# Vivado block design design_1, xczu28dr-ffvg1517-2-e, Vivado 2019.1
# (continued, part 2 of 3)
current_bd_instance /SPB_blocks

create_bd_cell -type hier PD_FLAG_block
create_bd_cell -type hier stream_0
create_bd_cell -type hier stream_1
create_bd_cell -type hier stream_2
create_bd_cell -type hier stream_3
create_bd_cell -type hier soft_reset
create_bd_cell -type ip -vlnv xilinx.com:ip:ila:6.2 ila_0
set_property -dict [list \
  CONFIG.C_ENABLE_ILA_AXI_MON false \
  CONFIG.C_MONITOR_TYPE Native \
  CONFIG.C_NUM_OF_PROBES 6 \
  CONFIG.C_TRIGIN_EN false \
] [get_bd_cells ila_0]

# ---- hierarchy /SPB_blocks/PD_FLAG_block ----
current_bd_instance /SPB_blocks/PD_FLAG_block
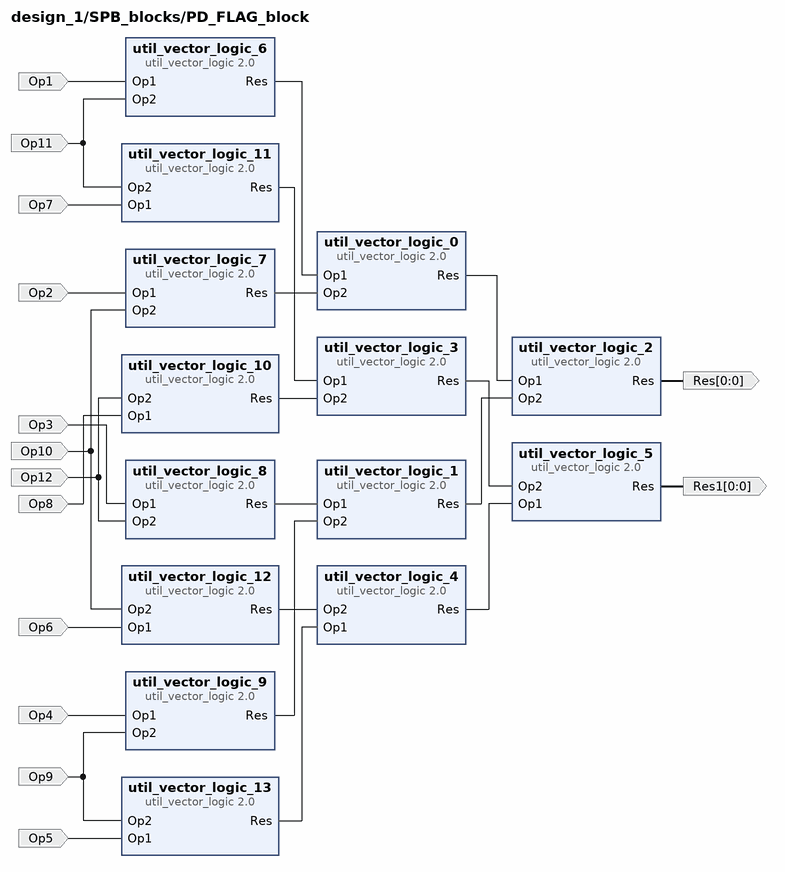
[diagram p20: block diagram inside /SPB_blocks/PD_FLAG_block]
create_bd_pin -dir I Op2
create_bd_pin -dir I Op3
create_bd_pin -dir I Op4
create_bd_pin -dir O -from 0 -to 0 Res
create_bd_pin -dir I Op5
create_bd_pin -dir O -from 0 -to 0 Res1
create_bd_pin -dir I Op6
create_bd_pin -dir I Op7
create_bd_pin -dir I Op8
create_bd_pin -dir I Op1
create_bd_pin -dir I Op9
create_bd_pin -dir I Op10
create_bd_pin -dir I Op11
create_bd_pin -dir I Op12

create_bd_cell -type ip -vlnv xilinx.com:ip:util_vector_logic:2.0 util_vector_logic_0
set_property -dict {CONFIG.C_OPERATION or CONFIG.C_SIZE 1} [get_bd_cells util_vector_logic_0]
create_bd_cell -type ip -vlnv xilinx.com:ip:util_vector_logic:2.0 util_vector_logic_1
set_property -dict {CONFIG.C_OPERATION or CONFIG.C_SIZE 1} [get_bd_cells util_vector_logic_1]
create_bd_cell -type ip -vlnv xilinx.com:ip:util_vector_logic:2.0 util_vector_logic_2
set_property -dict {CONFIG.C_OPERATION or CONFIG.C_SIZE 1} [get_bd_cells util_vector_logic_2]
create_bd_cell -type ip -vlnv xilinx.com:ip:util_vector_logic:2.0 util_vector_logic_3
set_property -dict {CONFIG.C_OPERATION or CONFIG.C_SIZE 1} [get_bd_cells util_vector_logic_3]
create_bd_cell -type ip -vlnv xilinx.com:ip:util_vector_logic:2.0 util_vector_logic_4
set_property -dict {CONFIG.C_OPERATION or CONFIG.C_SIZE 1} [get_bd_cells util_vector_logic_4]
create_bd_cell -type ip -vlnv xilinx.com:ip:util_vector_logic:2.0 util_vector_logic_5
set_property -dict {CONFIG.C_OPERATION or CONFIG.C_SIZE 1} [get_bd_cells util_vector_logic_5]
create_bd_cell -type ip -vlnv xilinx.com:ip:util_vector_logic:2.0 util_vector_logic_6
set_property -dict {CONFIG.C_OPERATION and CONFIG.C_SIZE 1} [get_bd_cells util_vector_logic_6]
create_bd_cell -type ip -vlnv xilinx.com:ip:util_vector_logic:2.0 util_vector_logic_7
set_property -dict {CONFIG.C_OPERATION and CONFIG.C_SIZE 1} [get_bd_cells util_vector_logic_7]
create_bd_cell -type ip -vlnv xilinx.com:ip:util_vector_logic:2.0 util_vector_logic_8
set_property -dict {CONFIG.C_OPERATION and CONFIG.C_SIZE 1} [get_bd_cells util_vector_logic_8]
create_bd_cell -type ip -vlnv xilinx.com:ip:util_vector_logic:2.0 util_vector_logic_9
set_property -dict {CONFIG.C_OPERATION and CONFIG.C_SIZE 1} [get_bd_cells util_vector_logic_9]
create_bd_cell -type ip -vlnv xilinx.com:ip:util_vector_logic:2.0 util_vector_logic_10
set_property -dict {CONFIG.C_OPERATION and CONFIG.C_SIZE 1} [get_bd_cells util_vector_logic_10]
create_bd_cell -type ip -vlnv xilinx.com:ip:util_vector_logic:2.0 util_vector_logic_11
set_property -dict {CONFIG.C_OPERATION and CONFIG.C_SIZE 1} [get_bd_cells util_vector_logic_11]
create_bd_cell -type ip -vlnv xilinx.com:ip:util_vector_logic:2.0 util_vector_logic_12
set_property -dict {CONFIG.C_OPERATION and CONFIG.C_SIZE 1} [get_bd_cells util_vector_logic_12]
create_bd_cell -type ip -vlnv xilinx.com:ip:util_vector_logic:2.0 util_vector_logic_13
set_property -dict {CONFIG.C_OPERATION and CONFIG.C_SIZE 1} [get_bd_cells util_vector_logic_13]

# ---- hierarchy /SPB_blocks/stream_0 ----
current_bd_instance /SPB_blocks/stream_0
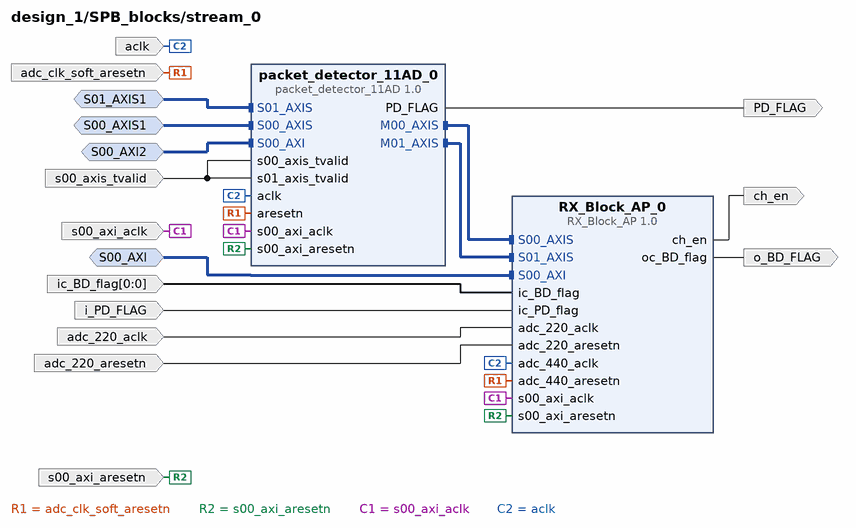
[diagram p21: block diagram inside /SPB_blocks/stream_0]
create_bd_intf_pin -mode Slave -vlnv xilinx.com:interface:axis_rtl:1.0 S01_AXIS1
create_bd_intf_pin -mode Slave -vlnv xilinx.com:interface:aximm_rtl:1.0 S00_AXI2
create_bd_intf_pin -mode Slave -vlnv xilinx.com:interface:axis_rtl:1.0 S00_AXIS1
create_bd_intf_pin -mode Slave -vlnv xilinx.com:interface:aximm_rtl:1.0 S00_AXI
create_bd_pin -dir I -type rst adc_clk_soft_aresetn
create_bd_pin -dir I -type rst s00_axi_aresetn
create_bd_pin -dir I -type clk s00_axi_aclk
create_bd_pin -dir I -type clk aclk
create_bd_pin -dir O PD_FLAG
create_bd_pin -dir I i_PD_FLAG
create_bd_pin -dir O o_BD_FLAG
create_bd_pin -dir I -from 0 -to 0 ic_BD_flag
create_bd_pin -dir I -type clk adc_220_aclk
create_bd_pin -dir I -type rst adc_220_aresetn
create_bd_pin -dir O ch_en
create_bd_pin -dir I s00_axis_tvalid

create_bd_cell -type ip -vlnv user.org:user:RX_Block_AP:1.0 RX_Block_AP_0
create_bd_cell -type ip -vlnv user.org:user:packet_detector_11AD:1.0 packet_detector_11AD_0

# ---- hierarchy /SPB_blocks/stream_1 ----
current_bd_instance /SPB_blocks/stream_1
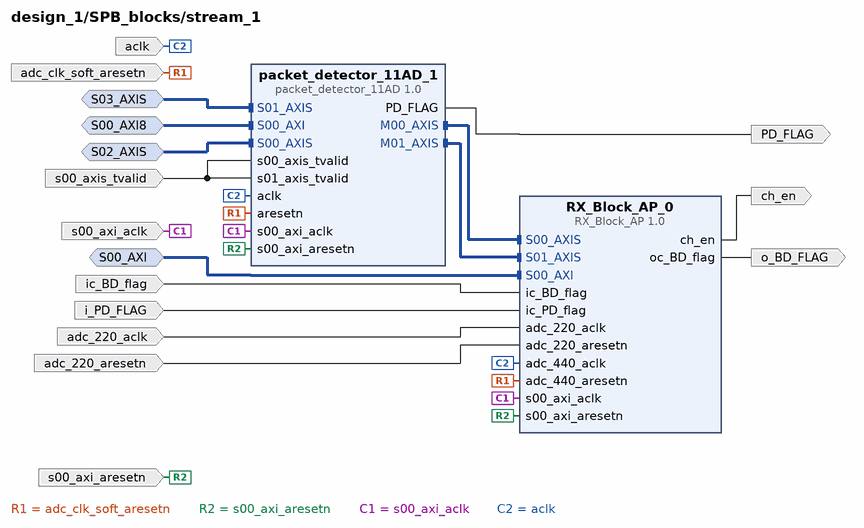
[diagram p22: block diagram inside /SPB_blocks/stream_1]
create_bd_intf_pin -mode Slave -vlnv xilinx.com:interface:axis_rtl:1.0 S03_AXIS
create_bd_intf_pin -mode Slave -vlnv xilinx.com:interface:aximm_rtl:1.0 S00_AXI8
create_bd_intf_pin -mode Slave -vlnv xilinx.com:interface:axis_rtl:1.0 S02_AXIS
create_bd_intf_pin -mode Slave -vlnv xilinx.com:interface:aximm_rtl:1.0 S00_AXI
create_bd_pin -dir I -type rst adc_clk_soft_aresetn
create_bd_pin -dir I -type rst s00_axi_aresetn
create_bd_pin -dir I -type clk s00_axi_aclk
create_bd_pin -dir I -type clk aclk
create_bd_pin -dir O PD_FLAG
create_bd_pin -dir I i_PD_FLAG
create_bd_pin -dir O o_BD_FLAG
create_bd_pin -dir I ic_BD_flag
create_bd_pin -dir I -type clk adc_220_aclk
create_bd_pin -dir I -type rst adc_220_aresetn
create_bd_pin -dir O ch_en
create_bd_pin -dir I s00_axis_tvalid

create_bd_cell -type ip -vlnv user.org:user:RX_Block_AP:1.0 RX_Block_AP_0
set_property -dict {CONFIG.STREAM 1} [get_bd_cells RX_Block_AP_0]
create_bd_cell -type ip -vlnv user.org:user:packet_detector_11AD:1.0 packet_detector_11AD_1

# ---- hierarchy /SPB_blocks/stream_2 ----
current_bd_instance /SPB_blocks/stream_2
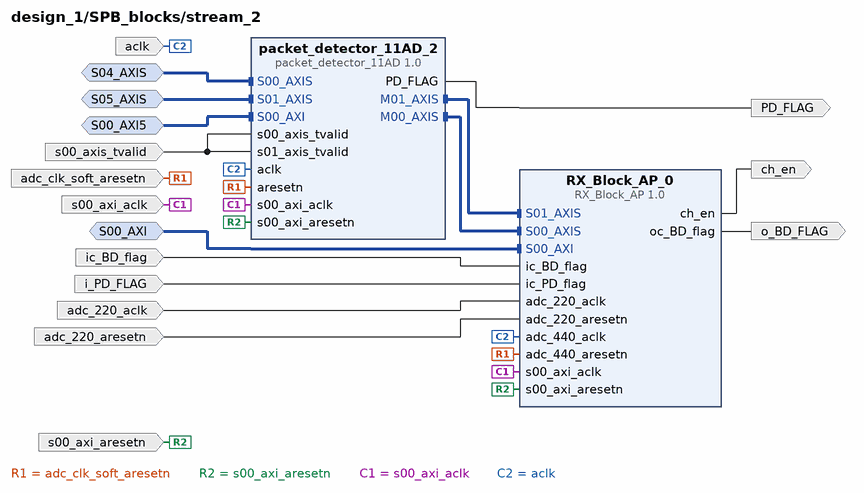
[diagram p23: block diagram inside /SPB_blocks/stream_2]
create_bd_intf_pin -mode Slave -vlnv xilinx.com:interface:aximm_rtl:1.0 S00_AXI5
create_bd_intf_pin -mode Slave -vlnv xilinx.com:interface:axis_rtl:1.0 S04_AXIS
create_bd_intf_pin -mode Slave -vlnv xilinx.com:interface:axis_rtl:1.0 S05_AXIS
create_bd_intf_pin -mode Slave -vlnv xilinx.com:interface:aximm_rtl:1.0 S00_AXI
create_bd_pin -dir I -type rst adc_clk_soft_aresetn
create_bd_pin -dir I -type rst s00_axi_aresetn
create_bd_pin -dir I -type clk s00_axi_aclk
create_bd_pin -dir I -type clk aclk
create_bd_pin -dir O PD_FLAG
create_bd_pin -dir I i_PD_FLAG
create_bd_pin -dir O o_BD_FLAG
create_bd_pin -dir I ic_BD_flag
create_bd_pin -dir I -type clk adc_220_aclk
create_bd_pin -dir I -type rst adc_220_aresetn
create_bd_pin -dir O ch_en
create_bd_pin -dir I s00_axis_tvalid

create_bd_cell -type ip -vlnv user.org:user:RX_Block_AP:1.0 RX_Block_AP_0
set_property -dict {CONFIG.STREAM 2} [get_bd_cells RX_Block_AP_0]
create_bd_cell -type ip -vlnv user.org:user:packet_detector_11AD:1.0 packet_detector_11AD_2

# ---- hierarchy /SPB_blocks/stream_3 ----
current_bd_instance /SPB_blocks/stream_3
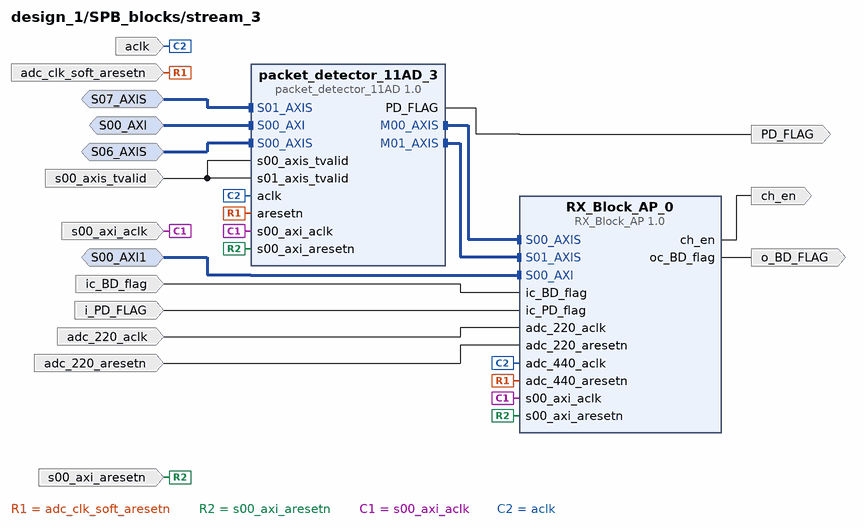
[diagram p24: block diagram inside /SPB_blocks/stream_3]
create_bd_intf_pin -mode Slave -vlnv xilinx.com:interface:aximm_rtl:1.0 S00_AXI
create_bd_intf_pin -mode Slave -vlnv xilinx.com:interface:axis_rtl:1.0 S06_AXIS
create_bd_intf_pin -mode Slave -vlnv xilinx.com:interface:axis_rtl:1.0 S07_AXIS
create_bd_intf_pin -mode Slave -vlnv xilinx.com:interface:aximm_rtl:1.0 S00_AXI1
create_bd_pin -dir I -type rst adc_clk_soft_aresetn
create_bd_pin -dir I -type rst s00_axi_aresetn
create_bd_pin -dir I -type clk s00_axi_aclk
create_bd_pin -dir I -type clk aclk
create_bd_pin -dir O PD_FLAG
create_bd_pin -dir I i_PD_FLAG
create_bd_pin -dir I ic_BD_flag
create_bd_pin -dir O o_BD_FLAG
create_bd_pin -dir I -type clk adc_220_aclk
create_bd_pin -dir I -type rst adc_220_aresetn
create_bd_pin -dir O ch_en
create_bd_pin -dir I s00_axis_tvalid

create_bd_cell -type ip -vlnv user.org:user:RX_Block_AP:1.0 RX_Block_AP_0
set_property -dict {CONFIG.STREAM 3} [get_bd_cells RX_Block_AP_0]
create_bd_cell -type ip -vlnv user.org:user:packet_detector_11AD:1.0 packet_detector_11AD_3

# ---- hierarchy /SPB_blocks/soft_reset ----
current_bd_instance /SPB_blocks/soft_reset
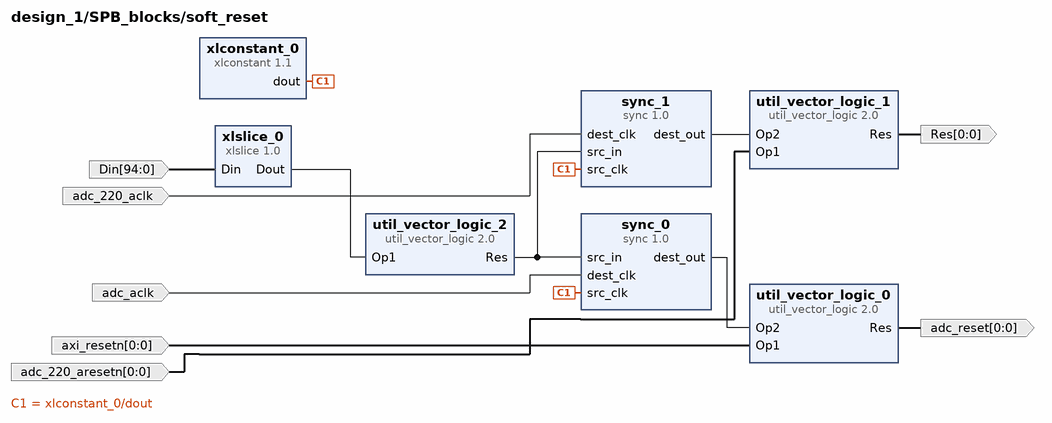
[diagram p25: block diagram inside /SPB_blocks/soft_reset]
create_bd_pin -dir I -type clk adc_aclk
create_bd_pin -dir I -from 0 -to 0 axi_resetn
create_bd_pin -dir O -from 0 -to 0 adc_reset
create_bd_pin -dir I -from 94 -to 0 Din
create_bd_pin -dir I -from 0 -to 0 adc_220_aresetn
create_bd_pin -dir O -from 0 -to 0 Res
create_bd_pin -dir I -type clk adc_220_aclk

create_bd_cell -type ip -vlnv xilinx.com:ip:xlslice:1.0 xlslice_0
set_property -dict {CONFIG.DIN_FROM 29 CONFIG.DIN_TO 29 CONFIG.DIN_WIDTH 95 CONFIG.DOUT_WIDTH 1} [get_bd_cells xlslice_0]
create_bd_cell -type ip -vlnv xilinx.com:ip:util_vector_logic:2.0 util_vector_logic_2
set_property -dict {CONFIG.C_OPERATION not CONFIG.C_SIZE 1} [get_bd_cells util_vector_logic_2]
create_bd_cell -type ip -vlnv xilinx.com:user:sync:1.0 sync_0
set_property -dict {CONFIG.SRC_INPUT_REG 0} [get_bd_cells sync_0]
create_bd_cell -type ip -vlnv xilinx.com:ip:xlconstant:1.1 xlconstant_0
set_property -dict {CONFIG.CONST_VAL 0} [get_bd_cells xlconstant_0]
create_bd_cell -type ip -vlnv xilinx.com:ip:util_vector_logic:2.0 util_vector_logic_0
set_property -dict {CONFIG.C_SIZE 1} [get_bd_cells util_vector_logic_0]
create_bd_cell -type ip -vlnv xilinx.com:ip:util_vector_logic:2.0 util_vector_logic_1
set_property -dict {CONFIG.C_SIZE 1} [get_bd_cells util_vector_logic_1]
create_bd_cell -type ip -vlnv xilinx.com:user:sync:1.0 sync_1
set_property -dict {CONFIG.SRC_INPUT_REG 0} [get_bd_cells sync_1]

# ---- connections ----

current_bd_instance /MTS_Block
connect_bd_intf_net [get_bd_intf_pins CLK_DIFF_PL_CLK] [get_bd_intf_pins util_ds_buf_0/CLK_IN_D]
connect_bd_intf_net [get_bd_intf_pins CLK_DIFF_SYSREF_CLK] [get_bd_intf_pins util_ds_buf_1/CLK_IN_D]
connect_bd_net [get_bd_pins util_ds_buf_0/IBUF_OUT] [get_bd_pins clk_wiz_0/clk_in1] [get_bd_pins sync_0/dest_clk]
connect_bd_net [get_bd_pins sync_0/dest_out] [get_bd_pins sync_1/src_in] [get_bd_pins sync_2/src_in]
connect_bd_net [get_bd_pins sync_1/dest_out] [get_bd_pins user_sysref_dac]
connect_bd_net [get_bd_pins xlconstant_0/dout] [get_bd_pins sync_0/src_clk] [get_bd_pins sync_1/src_clk] [get_bd_pins sync_2/src_clk]
connect_bd_net [get_bd_pins util_ds_buf_1/IBUF_OUT] [get_bd_pins sync_0/src_in]
connect_bd_net [get_bd_pins sync_2/dest_out] [get_bd_pins user_sysref_adc]
connect_bd_net [get_bd_pins clk_wiz_0/clk_out3] [get_bd_pins adc45_clk] [get_bd_pins sync_2/dest_clk]
connect_bd_net [get_bd_pins clk_wiz_0/clk_out1] [get_bd_pins dac45_clk] [get_bd_pins sync_1/dest_clk]
connect_bd_net [get_bd_pins clk_wiz_0/clk_out2] [get_bd_pins dac_clk]
connect_bd_net [get_bd_pins clk_wiz_0/clk_out4] [get_bd_pins adc_clk]

current_bd_instance /reset_block
connect_bd_net -net zynq_ultra_ps_e_0_pl_clk0 [get_bd_pins slowest_sync_clk] [get_bd_pins rst_ps8_0_96M/slowest_sync_clk]
connect_bd_net -net zynq_ultra_ps_e_0_pl_resetn0 [get_bd_pins ext_reset_in] \
  [get_bd_pins rst_ps8_0_96M1/ext_reset_in] [get_bd_pins rst_ps8_0_96M/ext_reset_in] \
  [get_bd_pins rst_ps8_0_96M2/ext_reset_in]
connect_bd_net [get_bd_pins rst_ps8_0_96M/peripheral_aresetn] [get_bd_pins peripheral_aresetn]
connect_bd_net -net MTS_Block_dac_clk [get_bd_pins slowest_sync_clk1] [get_bd_pins rst_ps8_0_96M1/slowest_sync_clk]
connect_bd_net [get_bd_pins rst_ps8_0_96M1/peripheral_aresetn] [get_bd_pins peripheral_aresetn1]
connect_bd_net [get_bd_pins rst_ddr4_0_333M/peripheral_aresetn] [get_bd_pins peripheral_aresetn2]
connect_bd_net -net slowest_sync_clk2_1 [get_bd_pins slowest_sync_clk2] [get_bd_pins rst_ddr4_0_333M/slowest_sync_clk]
connect_bd_net -net ext_reset_in1_1 [get_bd_pins ext_reset_in1] [get_bd_pins rst_ddr4_0_333M/ext_reset_in]
connect_bd_net [get_bd_pins rst_ps8_0_96M2/peripheral_aresetn] [get_bd_pins peripheral_aresetn3]
connect_bd_net -net slowest_sync_clk3_1 [get_bd_pins slowest_sync_clk3] [get_bd_pins rst_ps8_0_96M2/slowest_sync_clk]

current_bd_instance /dac_dma_block
connect_bd_intf_net [get_bd_intf_pins M_AXI_MM2S] [get_bd_intf_pins axi_register_slice_0/M_AXI]
connect_bd_intf_net [get_bd_intf_pins axi_register_slice_0/S_AXI] [get_bd_intf_pins axi_dma_0/M_AXI_MM2S]
connect_bd_intf_net [get_bd_intf_pins S_AXI_LITE] [get_bd_intf_pins axi_dma_0/S_AXI_LITE]
connect_bd_intf_net [get_bd_intf_pins M03_AXIS] [get_bd_intf_pins axis_broadcaster_0/M03_AXIS]
connect_bd_intf_net [get_bd_intf_pins M02_AXIS] [get_bd_intf_pins axis_broadcaster_0/M02_AXIS]
connect_bd_intf_net [get_bd_intf_pins M01_AXIS] [get_bd_intf_pins axis_broadcaster_0/M01_AXIS]
connect_bd_intf_net [get_bd_intf_pins axis_register_slice_0/M_AXIS] [get_bd_intf_pins axis_broadcaster_0/S_AXIS]
connect_bd_intf_net [get_bd_intf_pins M00_AXIS] [get_bd_intf_pins axis_broadcaster_0/M00_AXIS]
connect_bd_intf_net [get_bd_intf_pins axis_register_slice_0/S_AXIS] [get_bd_intf_pins axi_dma_0/M_AXIS_MM2S]
connect_bd_net -net zynq_ultra_ps_e_0_pl_clk0 [get_bd_pins s_axi_lite_aclk] [get_bd_pins axi_dma_0/s_axi_lite_aclk]
connect_bd_net -net rst_ps8_0_96M_peripheral_aresetn [get_bd_pins axi_resetn] [get_bd_pins axi_dma_0/axi_resetn]
connect_bd_net -net ddr4_0_c0_ddr4_ui_clk [get_bd_pins m_axi_mm2s_aclk] \
  [get_bd_pins axi_dma_0/m_axi_mm2s_aclk] [get_bd_pins axis_broadcaster_0/aclk] [get_bd_pins axi_register_slice_0/aclk] \
  [get_bd_pins axis_register_slice_0/aclk]
connect_bd_net [get_bd_pins aresetn_300Mhz] \
  [get_bd_pins axis_broadcaster_0/aresetn] [get_bd_pins axis_register_slice_0/aresetn] \
  [get_bd_pins axi_register_slice_0/aresetn]

current_bd_instance /control_block
connect_bd_net -net Din_0_1 [get_bd_pins Din_0] [get_bd_pins globalstart_gpio_adc/Din] [get_bd_pins globalstart_gpio_dac/Din]
connect_bd_net [get_bd_pins xlconstant_0/dout] [get_bd_pins sync_1/src_clk] [get_bd_pins sync_2/src_clk]
connect_bd_net [get_bd_pins sync_1/dest_out] [get_bd_pins adc_control]
connect_bd_net -net dest_clk_1 [get_bd_pins adc_clk] [get_bd_pins sync_1/dest_clk]
connect_bd_net [get_bd_pins globalstart_gpio_adc/Dout] [get_bd_pins sync_1/src_in]
connect_bd_net [get_bd_pins globalstart_gpio_dac/Dout] [get_bd_pins sync_2/src_in]
connect_bd_net [get_bd_pins dest_clk] [get_bd_pins sync_2/dest_clk]
connect_bd_net [get_bd_pins sync_2/dest_out] [get_bd_pins dac_control]

current_bd_instance /tx_datapath
connect_bd_intf_net [get_bd_intf_pins S00_AXI] [get_bd_intf_pins macro_channel_0/S00_AXI]
connect_bd_intf_net [get_bd_intf_pins SLOT_0_AXIS4] [get_bd_intf_pins macro_channel_3/SLOT_0_AXIS4]
connect_bd_intf_net [get_bd_intf_pins SLOT_0_AXIS5] [get_bd_intf_pins macro_channel_3/SLOT_0_AXIS5]
connect_bd_intf_net [get_bd_intf_pins S00_AXI4] [get_bd_intf_pins macro_channel_3/S00_AXI]
connect_bd_intf_net [get_bd_intf_pins S00_AXI3] [get_bd_intf_pins macro_channel_2/S00_AXI]
connect_bd_intf_net [get_bd_intf_pins SLOT_0_AXIS] [get_bd_intf_pins macro_channel_0/SLOT_0_AXIS]
connect_bd_intf_net [get_bd_intf_pins SLOT_0_AXIS2] [get_bd_intf_pins macro_channel_1/SLOT_0_AXIS2]
connect_bd_intf_net [get_bd_intf_pins SLOT_0_AXIS6] [get_bd_intf_pins macro_channel_2/SLOT_0_AXIS6]
connect_bd_intf_net [get_bd_intf_pins S00_AXI1] [get_bd_intf_pins macro_channel_0/S00_AXI1]
connect_bd_intf_net [get_bd_intf_pins S_AXIS] [get_bd_intf_pins macro_channel_0/S_AXIS]
connect_bd_intf_net [get_bd_intf_pins SLOT_0_AXIS3] [get_bd_intf_pins macro_channel_1/SLOT_0_AXIS3]
connect_bd_intf_net [get_bd_intf_pins SLOT_0_AXIS7] [get_bd_intf_pins macro_channel_2/SLOT_0_AXIS7]
connect_bd_intf_net [get_bd_intf_pins SLOT_0_AXIS1] [get_bd_intf_pins macro_channel_0/SLOT_0_AXIS1]
connect_bd_intf_net [get_bd_intf_pins S_AXIS1] [get_bd_intf_pins macro_channel_1/S_AXIS1]
connect_bd_intf_net [get_bd_intf_pins S_AXIS3] [get_bd_intf_pins macro_channel_3/S_AXIS2]
connect_bd_intf_net [get_bd_intf_pins S_AXIS2] [get_bd_intf_pins macro_channel_2/S_AXIS3]
connect_bd_intf_net [get_bd_intf_pins S00_AXI2] [get_bd_intf_pins macro_channel_1/S00_AXI]
connect_bd_net [get_bd_pins dac_aclk] \
  [get_bd_pins macro_channel_0/dac_aclk] [get_bd_pins macro_channel_1/dac_aclk] [get_bd_pins macro_channel_2/dac_aclk] \
  [get_bd_pins macro_channel_3/dac_aclk]
connect_bd_net [get_bd_pins axis_aclk] \
  [get_bd_pins macro_channel_0/axis_aclk] [get_bd_pins macro_channel_1/axis_aclk] [get_bd_pins macro_channel_2/axis_aclk] \
  [get_bd_pins macro_channel_3/axis_aclk]
connect_bd_net [get_bd_pins axi_resetn] \
  [get_bd_pins macro_channel_0/axi_resetn] [get_bd_pins macro_channel_1/axi_resetn] [get_bd_pins macro_channel_2/axi_resetn] \
  [get_bd_pins macro_channel_3/axi_resetn]
connect_bd_net [get_bd_pins dac_clk_aresetn] \
  [get_bd_pins macro_channel_0/dac_clk_aresetn] [get_bd_pins macro_channel_1/dac_clk_aresetn] \
  [get_bd_pins macro_channel_2/dac_clk_aresetn] [get_bd_pins macro_channel_3/dac_clk_aresetn]
connect_bd_net [get_bd_pins Din] \
  [get_bd_pins macro_channel_0/Din] [get_bd_pins macro_channel_1/Din] [get_bd_pins macro_channel_2/Din] \
  [get_bd_pins macro_channel_3/Din]
connect_bd_net [get_bd_pins send_pkt_i] \
  [get_bd_pins macro_channel_0/send_pkt_i] [get_bd_pins macro_channel_2/send_pkt_i] [get_bd_pins macro_channel_3/send_pkt_i] \
  [get_bd_pins macro_channel_1/send_pkt_i]
connect_bd_net [get_bd_pins macro_channel_0/o_INC_BP_4] [get_bd_pins o_INC_BP_4]
connect_bd_net -net Op2_1 [get_bd_pins Op2] [get_bd_pins macro_channel_0/Op2]
connect_bd_net -net Op2_2 [get_bd_pins Op3] [get_bd_pins macro_channel_1/Op2]
connect_bd_net -net Op2_3 [get_bd_pins Op4] [get_bd_pins macro_channel_2/Op2]
connect_bd_net -net Op2_4 [get_bd_pins Op5] [get_bd_pins macro_channel_3/Op2]
connect_bd_net [get_bd_pins s00_axi_aclk] \
  [get_bd_pins macro_channel_0/s00_axi_aclk] [get_bd_pins macro_channel_1/pl_clk0] [get_bd_pins macro_channel_2/pl_clk0] \
  [get_bd_pins macro_channel_3/pl_clk0]
connect_bd_net [get_bd_pins s00_axi_aresetn] \
  [get_bd_pins macro_channel_0/s00_axi_aresetn] [get_bd_pins macro_channel_1/peripheral_aresetn] \
  [get_bd_pins macro_channel_2/peripheral_aresetn] [get_bd_pins macro_channel_3/peripheral_aresetn]
connect_bd_net [get_bd_pins macro_channel_0/o_RTN_BP_0] [get_bd_pins o_RTN_BP_0]

current_bd_instance /tx_datapath/macro_channel_0
connect_bd_intf_net [get_bd_intf_pins S00_AXI] [get_bd_intf_pins TX_Block_AP_0/S00_AXI]
connect_bd_intf_net [get_bd_intf_pins SLOT_0_AXIS] [get_bd_intf_pins TX_Block_AP_0/M00_AXIS]
connect_bd_intf_net [get_bd_intf_pins SLOT_0_AXIS1] [get_bd_intf_pins TX_Block_AP_0/M01_AXIS]
connect_bd_intf_net [get_bd_intf_pins S_AXIS] [get_bd_intf_pins TX_Block_AP_0/S00_AXIS]
connect_bd_intf_net [get_bd_intf_pins S00_AXI1] [get_bd_intf_pins SIVERS_gpio_0/S00_AXI]
connect_bd_net [get_bd_pins axis_aclk] [get_bd_pins soft_reset/axis_aclk] [get_bd_pins localstart_0/axis_aclk] [get_bd_pins TX_Block_AP_0/aclk]
connect_bd_net [get_bd_pins dac_aclk] [get_bd_pins soft_reset/dac_aclk] [get_bd_pins SIVERS_gpio_0/aclk] [get_bd_pins TX_Block_AP_0/dac_aclk]
connect_bd_net [get_bd_pins axi_resetn] [get_bd_pins soft_reset/axi_resetn]
connect_bd_net [get_bd_pins dac_clk_aresetn] [get_bd_pins soft_reset/dac_clk_aresetn]
connect_bd_net [get_bd_pins Din] [get_bd_pins soft_reset/Din] [get_bd_pins loopback_0/Din] [get_bd_pins localstart_0/Din]
connect_bd_net [get_bd_pins soft_reset/dac_reset_soft] [get_bd_pins SIVERS_gpio_0/aresetn] [get_bd_pins TX_Block_AP_0/dac_aresetn]
connect_bd_net [get_bd_pins soft_reset/axi_reset_soft] [get_bd_pins TX_Block_AP_0/aresetn]
connect_bd_net [get_bd_pins loopback_0/Dout] [get_bd_pins TX_Block_AP_0/load_data_i]
connect_bd_net [get_bd_pins send_pkt_i] [get_bd_pins TX_Block_AP_0/send_pkt_i]
connect_bd_net -net Op2_1 [get_bd_pins Op2] [get_bd_pins localstart_0/Op2]
connect_bd_net [get_bd_pins localstart_0/Res] [get_bd_pins TX_Block_AP_0/s00_axis_tvalid]
connect_bd_net [get_bd_pins s00_axi_aclk] [get_bd_pins SIVERS_gpio_0/s00_axi_aclk] [get_bd_pins TX_Block_AP_0/s00_axi_aclk]
connect_bd_net [get_bd_pins s00_axi_aresetn] [get_bd_pins SIVERS_gpio_0/s00_axi_aresetn] [get_bd_pins TX_Block_AP_0/s00_axi_aresetn]
connect_bd_net [get_bd_pins SIVERS_gpio_0/o_INC_BP] [get_bd_pins o_INC_BP_4]
connect_bd_net [get_bd_pins SIVERS_gpio_0/o_RTN_BP] [get_bd_pins o_RTN_BP_0]
connect_bd_net [get_bd_pins TX_Block_AP_0/trn_pulse_o] [get_bd_pins SIVERS_gpio_0/i_TRIGGER]

current_bd_instance /tx_datapath/macro_channel_0/soft_reset
connect_bd_net [get_bd_pins xlslice_0/Dout] [get_bd_pins util_vector_logic_2/Op1]
connect_bd_net [get_bd_pins util_vector_logic_2/Res] [get_bd_pins sync_1/src_in] [get_bd_pins sync_0/src_in]
connect_bd_net [get_bd_pins sync_1/dest_out] [get_bd_pins util_vector_logic_0/Op1]
connect_bd_net [get_bd_pins sync_0/dest_out] [get_bd_pins util_vector_logic_1/Op1]
connect_bd_net [get_bd_pins xlconstant_0/dout] [get_bd_pins sync_1/src_clk] [get_bd_pins sync_0/src_clk]
connect_bd_net [get_bd_pins dac_clk_aresetn] [get_bd_pins util_vector_logic_0/Op2]
connect_bd_net [get_bd_pins util_vector_logic_0/Res] [get_bd_pins dac_reset_soft]
connect_bd_net [get_bd_pins dac_aclk] [get_bd_pins sync_1/dest_clk]
connect_bd_net [get_bd_pins axis_aclk] [get_bd_pins sync_0/dest_clk]
connect_bd_net [get_bd_pins axi_resetn] [get_bd_pins util_vector_logic_1/Op2]
connect_bd_net [get_bd_pins util_vector_logic_1/Res] [get_bd_pins axi_reset_soft]
connect_bd_net [get_bd_pins Din] [get_bd_pins xlslice_0/Din]

current_bd_instance /tx_datapath/macro_channel_0/localstart_0
connect_bd_net [get_bd_pins xlconstant_0/dout] [get_bd_pins sync_0/src_clk]
connect_bd_net [get_bd_pins axis_aclk] [get_bd_pins sync_0/dest_clk]
connect_bd_net [get_bd_pins Din] [get_bd_pins xlslice_0/Din]
connect_bd_net [get_bd_pins sync_0/dest_out] [get_bd_pins util_vector_logic_1/Op1]
connect_bd_net -net Op2_1 [get_bd_pins Op2] [get_bd_pins util_vector_logic_1/Op2]
connect_bd_net [get_bd_pins util_vector_logic_1/Res] [get_bd_pins Res]
connect_bd_net [get_bd_pins xlslice_0/Dout] [get_bd_pins sync_0/src_in]

current_bd_instance /tx_datapath/macro_channel_1
connect_bd_intf_net [get_bd_intf_pins S00_AXI] [get_bd_intf_pins TX_Block_AP_1/S00_AXI]
connect_bd_intf_net [get_bd_intf_pins S_AXIS1] [get_bd_intf_pins TX_Block_AP_1/S00_AXIS]
connect_bd_intf_net [get_bd_intf_pins SLOT_0_AXIS3] [get_bd_intf_pins TX_Block_AP_1/M01_AXIS]
connect_bd_intf_net [get_bd_intf_pins SLOT_0_AXIS2] [get_bd_intf_pins TX_Block_AP_1/M00_AXIS]
connect_bd_net [get_bd_pins axis_aclk] [get_bd_pins soft_reset/axis_aclk] [get_bd_pins localstart_0/axis_aclk] [get_bd_pins TX_Block_AP_1/aclk]
connect_bd_net [get_bd_pins dac_aclk] [get_bd_pins soft_reset/dac_aclk] [get_bd_pins TX_Block_AP_1/dac_aclk]
connect_bd_net [get_bd_pins soft_reset/dac_reset_soft] [get_bd_pins TX_Block_AP_1/dac_aresetn]
connect_bd_net [get_bd_pins soft_reset/axi_reset_soft] [get_bd_pins TX_Block_AP_1/aresetn]
connect_bd_net [get_bd_pins Din] [get_bd_pins soft_reset/Din] [get_bd_pins loopback_0/Din] [get_bd_pins localstart_0/Din]
connect_bd_net [get_bd_pins axi_resetn] [get_bd_pins soft_reset/axi_resetn]
connect_bd_net [get_bd_pins dac_clk_aresetn] [get_bd_pins soft_reset/dac_clk_aresetn]
connect_bd_net [get_bd_pins loopback_0/Dout] [get_bd_pins TX_Block_AP_1/load_data_i]
connect_bd_net [get_bd_pins send_pkt_i] [get_bd_pins TX_Block_AP_1/send_pkt_i]
connect_bd_net [get_bd_pins localstart_0/Res] [get_bd_pins TX_Block_AP_1/s00_axis_tvalid]
connect_bd_net -net Op2_1 [get_bd_pins Op2] [get_bd_pins localstart_0/Op2]
connect_bd_net -net pl_clk0_1 [get_bd_pins pl_clk0] [get_bd_pins TX_Block_AP_1/s00_axi_aclk]
connect_bd_net [get_bd_pins peripheral_aresetn] [get_bd_pins TX_Block_AP_1/s00_axi_aresetn]

current_bd_instance /tx_datapath/macro_channel_1/soft_reset
connect_bd_net [get_bd_pins xlslice_0/Dout] [get_bd_pins util_vector_logic_2/Op1]
connect_bd_net [get_bd_pins util_vector_logic_2/Res] [get_bd_pins sync_1/src_in] [get_bd_pins sync_0/src_in]
connect_bd_net [get_bd_pins sync_1/dest_out] [get_bd_pins util_vector_logic_0/Op1]
connect_bd_net [get_bd_pins sync_0/dest_out] [get_bd_pins util_vector_logic_1/Op1]
connect_bd_net [get_bd_pins xlconstant_0/dout] [get_bd_pins sync_1/src_clk] [get_bd_pins sync_0/src_clk]
connect_bd_net [get_bd_pins dac_clk_aresetn] [get_bd_pins util_vector_logic_0/Op2]
connect_bd_net [get_bd_pins util_vector_logic_0/Res] [get_bd_pins dac_reset_soft]
connect_bd_net [get_bd_pins dac_aclk] [get_bd_pins sync_1/dest_clk]
connect_bd_net [get_bd_pins axis_aclk] [get_bd_pins sync_0/dest_clk]
connect_bd_net [get_bd_pins axi_resetn] [get_bd_pins util_vector_logic_1/Op2]
connect_bd_net [get_bd_pins util_vector_logic_1/Res] [get_bd_pins axi_reset_soft]
connect_bd_net [get_bd_pins Din] [get_bd_pins xlslice_0/Din]

current_bd_instance /tx_datapath/macro_channel_1/localstart_0
connect_bd_net [get_bd_pins xlconstant_0/dout] [get_bd_pins sync_0/src_clk]
connect_bd_net [get_bd_pins axis_aclk] [get_bd_pins sync_0/dest_clk]
connect_bd_net [get_bd_pins Din] [get_bd_pins xlslice_0/Din]
connect_bd_net [get_bd_pins sync_0/dest_out] [get_bd_pins util_vector_logic_1/Op1]
connect_bd_net -net Op2_1 [get_bd_pins Op2] [get_bd_pins util_vector_logic_1/Op2]
connect_bd_net [get_bd_pins util_vector_logic_1/Res] [get_bd_pins Res]
connect_bd_net [get_bd_pins xlslice_0/Dout] [get_bd_pins sync_0/src_in]

current_bd_instance /tx_datapath/macro_channel_2
connect_bd_intf_net [get_bd_intf_pins SLOT_0_AXIS6] [get_bd_intf_pins TX_Block_AP_2/M00_AXIS]
connect_bd_intf_net [get_bd_intf_pins S_AXIS3] [get_bd_intf_pins TX_Block_AP_2/S00_AXIS]
connect_bd_intf_net [get_bd_intf_pins S00_AXI] [get_bd_intf_pins TX_Block_AP_2/S00_AXI]
connect_bd_intf_net [get_bd_intf_pins SLOT_0_AXIS7] [get_bd_intf_pins TX_Block_AP_2/M01_AXIS]
connect_bd_net [get_bd_pins axis_aclk] [get_bd_pins soft_reset/axis_aclk] [get_bd_pins localstart_0/axis_aclk] [get_bd_pins TX_Block_AP_2/aclk]
connect_bd_net [get_bd_pins dac_aclk] [get_bd_pins soft_reset/dac_aclk] [get_bd_pins TX_Block_AP_2/dac_aclk]
connect_bd_net [get_bd_pins dac_clk_aresetn] [get_bd_pins soft_reset/dac_clk_aresetn]
connect_bd_net [get_bd_pins axi_resetn] [get_bd_pins soft_reset/axi_resetn]
connect_bd_net [get_bd_pins Din] [get_bd_pins soft_reset/Din] [get_bd_pins loopback_0/Din] [get_bd_pins localstart_0/Din]
connect_bd_net [get_bd_pins soft_reset/dac_reset_soft] [get_bd_pins TX_Block_AP_2/dac_aresetn]
connect_bd_net [get_bd_pins soft_reset/axi_reset_soft] [get_bd_pins TX_Block_AP_2/aresetn]
connect_bd_net [get_bd_pins loopback_0/Dout] [get_bd_pins TX_Block_AP_2/load_data_i]
connect_bd_net [get_bd_pins send_pkt_i] [get_bd_pins TX_Block_AP_2/send_pkt_i]
connect_bd_net [get_bd_pins localstart_0/Res] [get_bd_pins TX_Block_AP_2/s00_axis_tvalid]
connect_bd_net -net Op2_1 [get_bd_pins Op2] [get_bd_pins localstart_0/Op2]
connect_bd_net -net pl_clk0_1 [get_bd_pins pl_clk0] [get_bd_pins TX_Block_AP_2/s00_axi_aclk]
connect_bd_net [get_bd_pins peripheral_aresetn] [get_bd_pins TX_Block_AP_2/s00_axi_aresetn]

current_bd_instance /tx_datapath/macro_channel_2/soft_reset
connect_bd_net [get_bd_pins xlslice_0/Dout] [get_bd_pins util_vector_logic_2/Op1]
connect_bd_net [get_bd_pins util_vector_logic_2/Res] [get_bd_pins sync_1/src_in] [get_bd_pins sync_0/src_in]
connect_bd_net [get_bd_pins sync_1/dest_out] [get_bd_pins util_vector_logic_0/Op1]
connect_bd_net [get_bd_pins sync_0/dest_out] [get_bd_pins util_vector_logic_1/Op1]
connect_bd_net [get_bd_pins xlconstant_0/dout] [get_bd_pins sync_1/src_clk] [get_bd_pins sync_0/src_clk]
connect_bd_net [get_bd_pins dac_clk_aresetn] [get_bd_pins util_vector_logic_0/Op2]
connect_bd_net [get_bd_pins util_vector_logic_0/Res] [get_bd_pins dac_reset_soft]
connect_bd_net [get_bd_pins dac_aclk] [get_bd_pins sync_1/dest_clk]
connect_bd_net [get_bd_pins axis_aclk] [get_bd_pins sync_0/dest_clk]
connect_bd_net [get_bd_pins axi_resetn] [get_bd_pins util_vector_logic_1/Op2]
connect_bd_net [get_bd_pins util_vector_logic_1/Res] [get_bd_pins axi_reset_soft]
connect_bd_net [get_bd_pins Din] [get_bd_pins xlslice_0/Din]

current_bd_instance /tx_datapath/macro_channel_2/localstart_0
connect_bd_net [get_bd_pins xlconstant_0/dout] [get_bd_pins sync_0/src_clk]
connect_bd_net [get_bd_pins axis_aclk] [get_bd_pins sync_0/dest_clk]
connect_bd_net [get_bd_pins Din] [get_bd_pins xlslice_0/Din]
connect_bd_net [get_bd_pins sync_0/dest_out] [get_bd_pins util_vector_logic_1/Op1]
connect_bd_net -net Op2_1 [get_bd_pins Op2] [get_bd_pins util_vector_logic_1/Op2]
connect_bd_net [get_bd_pins util_vector_logic_1/Res] [get_bd_pins Res]
connect_bd_net [get_bd_pins xlslice_0/Dout] [get_bd_pins sync_0/src_in]

current_bd_instance /tx_datapath/macro_channel_3
connect_bd_intf_net [get_bd_intf_pins S00_AXI] [get_bd_intf_pins TX_Block_AP_3/S00_AXI]
connect_bd_intf_net [get_bd_intf_pins SLOT_0_AXIS4] [get_bd_intf_pins TX_Block_AP_3/M00_AXIS]
connect_bd_intf_net [get_bd_intf_pins S_AXIS2] [get_bd_intf_pins TX_Block_AP_3/S00_AXIS]
connect_bd_intf_net [get_bd_intf_pins SLOT_0_AXIS5] [get_bd_intf_pins TX_Block_AP_3/M01_AXIS]
connect_bd_net [get_bd_pins axis_aclk] [get_bd_pins soft_reset/axis_aclk] [get_bd_pins localstart_0/axis_aclk] [get_bd_pins TX_Block_AP_3/aclk]
connect_bd_net [get_bd_pins dac_aclk] [get_bd_pins soft_reset/dac_aclk] [get_bd_pins TX_Block_AP_3/dac_aclk]
connect_bd_net [get_bd_pins soft_reset/dac_reset_soft] [get_bd_pins TX_Block_AP_3/dac_aresetn]
connect_bd_net [get_bd_pins soft_reset/axi_reset_soft] [get_bd_pins TX_Block_AP_3/aresetn]
connect_bd_net [get_bd_pins Din] [get_bd_pins soft_reset/Din] [get_bd_pins loopback_0/Din] [get_bd_pins localstart_0/Din]
connect_bd_net [get_bd_pins axi_resetn] [get_bd_pins soft_reset/axi_resetn]
connect_bd_net [get_bd_pins dac_clk_aresetn] [get_bd_pins soft_reset/dac_clk_aresetn]
connect_bd_net [get_bd_pins loopback_0/Dout] [get_bd_pins TX_Block_AP_3/load_data_i]
connect_bd_net [get_bd_pins send_pkt_i] [get_bd_pins TX_Block_AP_3/send_pkt_i]
connect_bd_net [get_bd_pins localstart_0/Res] [get_bd_pins TX_Block_AP_3/s00_axis_tvalid]
connect_bd_net -net Op2_1 [get_bd_pins Op2] [get_bd_pins localstart_0/Op2]
connect_bd_net -net pl_clk0_1 [get_bd_pins pl_clk0] [get_bd_pins TX_Block_AP_3/s00_axi_aclk]
connect_bd_net [get_bd_pins peripheral_aresetn] [get_bd_pins TX_Block_AP_3/s00_axi_aresetn]

current_bd_instance /tx_datapath/macro_channel_3/soft_reset
connect_bd_net [get_bd_pins xlslice_0/Dout] [get_bd_pins util_vector_logic_2/Op1]
connect_bd_net [get_bd_pins util_vector_logic_2/Res] [get_bd_pins sync_1/src_in] [get_bd_pins sync_0/src_in]
connect_bd_net [get_bd_pins sync_1/dest_out] [get_bd_pins util_vector_logic_0/Op1]
connect_bd_net [get_bd_pins sync_0/dest_out] [get_bd_pins util_vector_logic_1/Op1]
connect_bd_net [get_bd_pins xlconstant_0/dout] [get_bd_pins sync_1/src_clk] [get_bd_pins sync_0/src_clk]
connect_bd_net [get_bd_pins dac_clk_aresetn] [get_bd_pins util_vector_logic_0/Op2]
connect_bd_net [get_bd_pins util_vector_logic_0/Res] [get_bd_pins dac_reset_soft]
connect_bd_net [get_bd_pins dac_aclk] [get_bd_pins sync_1/dest_clk]
connect_bd_net [get_bd_pins axis_aclk] [get_bd_pins sync_0/dest_clk]
connect_bd_net [get_bd_pins axi_resetn] [get_bd_pins util_vector_logic_1/Op2]
connect_bd_net [get_bd_pins util_vector_logic_1/Res] [get_bd_pins axi_reset_soft]
connect_bd_net [get_bd_pins Din] [get_bd_pins xlslice_0/Din]

current_bd_instance /tx_datapath/macro_channel_3/localstart_0
connect_bd_net [get_bd_pins xlconstant_0/dout] [get_bd_pins sync_0/src_clk]
connect_bd_net [get_bd_pins axis_aclk] [get_bd_pins sync_0/dest_clk]
connect_bd_net [get_bd_pins Din] [get_bd_pins xlslice_0/Din]
connect_bd_net [get_bd_pins sync_0/dest_out] [get_bd_pins util_vector_logic_1/Op1]
connect_bd_net -net Op2_1 [get_bd_pins Op2] [get_bd_pins util_vector_logic_1/Op2]
connect_bd_net [get_bd_pins util_vector_logic_1/Res] [get_bd_pins Res]
connect_bd_net [get_bd_pins xlslice_0/Dout] [get_bd_pins sync_0/src_in]

current_bd_instance /ddr_block
connect_bd_intf_net [get_bd_intf_pins S00_AXI] [get_bd_intf_pins smartconnect_0/S00_AXI]
connect_bd_intf_net [get_bd_intf_pins smartconnect_0/M00_AXI] [get_bd_intf_pins ddr4_0/C0_DDR4_S_AXI]
connect_bd_intf_net [get_bd_intf_pins S01_AXI] [get_bd_intf_pins smartconnect_0/S01_AXI]
connect_bd_intf_net [get_bd_intf_pins C0_DDR4_0] [get_bd_intf_pins ddr4_0/C0_DDR4]
connect_bd_intf_net [get_bd_intf_pins user_si570_sysclk] [get_bd_intf_pins ddr4_0/C0_SYS_CLK]
connect_bd_net [get_bd_pins c0_ddr4_aresetn] [get_bd_pins smartconnect_0/aresetn] [get_bd_pins ddr4_0/c0_ddr4_aresetn]
connect_bd_net [get_bd_pins ddr4_0/c0_ddr4_ui_clk] [get_bd_pins c0_ddr4_ui_clk] [get_bd_pins smartconnect_0/aclk]
connect_bd_net [get_bd_pins ddr4_0/c0_ddr4_ui_clk_sync_rst] [get_bd_pins c0_ddr4_ui_clk_sync_rst]
connect_bd_net [get_bd_pins reset] [get_bd_pins ddr4_0/sys_rst]

current_bd_instance /SPB_blocks
connect_bd_intf_net [get_bd_intf_pins S00_AXI] [get_bd_intf_pins stream_3/S00_AXI]
connect_bd_intf_net [get_bd_intf_pins S03_AXIS] [get_bd_intf_pins stream_1/S03_AXIS]
connect_bd_intf_net [get_bd_intf_pins S00_AXI1] [get_bd_intf_pins stream_0/S00_AXI]
connect_bd_intf_net [get_bd_intf_pins S00_AXI8] [get_bd_intf_pins stream_1/S00_AXI8]
connect_bd_intf_net [get_bd_intf_pins S00_AXI3] [get_bd_intf_pins stream_1/S00_AXI]
connect_bd_intf_net [get_bd_intf_pins S02_AXIS] [get_bd_intf_pins stream_1/S02_AXIS]
connect_bd_intf_net [get_bd_intf_pins S00_AXI2] [get_bd_intf_pins stream_0/S00_AXI2]
connect_bd_intf_net [get_bd_intf_pins S00_AXI5] [get_bd_intf_pins stream_2/S00_AXI5]
connect_bd_intf_net [get_bd_intf_pins S06_AXIS] [get_bd_intf_pins stream_3/S06_AXIS]
connect_bd_intf_net [get_bd_intf_pins S00_AXI7] [get_bd_intf_pins stream_3/S00_AXI1]
connect_bd_intf_net [get_bd_intf_pins S07_AXIS] [get_bd_intf_pins stream_3/S07_AXIS]
connect_bd_intf_net [get_bd_intf_pins S04_AXIS] [get_bd_intf_pins stream_2/S04_AXIS]
connect_bd_intf_net [get_bd_intf_pins S01_AXIS1] [get_bd_intf_pins stream_0/S01_AXIS1]
connect_bd_intf_net [get_bd_intf_pins S05_AXIS] [get_bd_intf_pins stream_2/S05_AXIS]
connect_bd_intf_net [get_bd_intf_pins S00_AXI6] [get_bd_intf_pins stream_2/S00_AXI]
connect_bd_intf_net [get_bd_intf_pins S00_AXIS1] [get_bd_intf_pins stream_0/S00_AXIS1]
connect_bd_net -net Op2_1 [get_bd_pins stream_1/PD_FLAG] [get_bd_pins PD_FLAG_block/Op2]
connect_bd_net -net Op3_1 [get_bd_pins stream_3/PD_FLAG] [get_bd_pins PD_FLAG_block/Op3]
connect_bd_net -net Op4_1 [get_bd_pins stream_0/PD_FLAG] [get_bd_pins PD_FLAG_block/Op4]
connect_bd_net -net PD_FLAG1_1 [get_bd_pins PD_FLAG_block/Res] \
  [get_bd_pins stream_0/i_PD_FLAG] [get_bd_pins stream_1/i_PD_FLAG] [get_bd_pins stream_2/i_PD_FLAG] \
  [get_bd_pins stream_3/i_PD_FLAG]
connect_bd_net [get_bd_pins stream_0/o_BD_FLAG] [get_bd_pins PD_FLAG_block/Op5] [get_bd_pins ila_0/probe2]
connect_bd_net [get_bd_pins stream_1/o_BD_FLAG] [get_bd_pins PD_FLAG_block/Op6] [get_bd_pins ila_0/probe0]
connect_bd_net [get_bd_pins stream_2/o_BD_FLAG] [get_bd_pins PD_FLAG_block/Op7] [get_bd_pins ila_0/probe1]
connect_bd_net [get_bd_pins stream_3/o_BD_FLAG] [get_bd_pins PD_FLAG_block/Op8] [get_bd_pins ila_0/probe3]
connect_bd_net -net Op1_1 [get_bd_pins stream_2/PD_FLAG] [get_bd_pins PD_FLAG_block/Op1]
connect_bd_net [get_bd_pins stream_0/ch_en] [get_bd_pins PD_FLAG_block/Op9]
connect_bd_net [get_bd_pins stream_1/ch_en] [get_bd_pins PD_FLAG_block/Op10]
connect_bd_net [get_bd_pins stream_2/ch_en] [get_bd_pins PD_FLAG_block/Op11]
connect_bd_net [get_bd_pins stream_3/ch_en] [get_bd_pins PD_FLAG_block/Op12]
connect_bd_net [get_bd_pins soft_reset/adc_reset] \
  [get_bd_pins stream_3/adc_clk_soft_aresetn] [get_bd_pins stream_0/adc_clk_soft_aresetn] \
  [get_bd_pins stream_2/adc_clk_soft_aresetn] [get_bd_pins stream_1/adc_clk_soft_aresetn]
connect_bd_net -net adc_220_aresetn_2 [get_bd_pins soft_reset/Res] \
  [get_bd_pins stream_2/adc_220_aresetn] [get_bd_pins stream_3/adc_220_aresetn] [get_bd_pins stream_1/adc_220_aresetn] \
  [get_bd_pins stream_0/adc_220_aresetn]
connect_bd_net [get_bd_pins adc_220_aresetn] [get_bd_pins soft_reset/adc_220_aresetn]
connect_bd_net [get_bd_pins adc_220_aclk] \
  [get_bd_pins stream_0/adc_220_aclk] [get_bd_pins stream_2/adc_220_aclk] [get_bd_pins stream_1/adc_220_aclk] \
  [get_bd_pins stream_3/adc_220_aclk] [get_bd_pins soft_reset/adc_220_aclk]
connect_bd_net [get_bd_pins s00_axi_aresetn] \
  [get_bd_pins stream_3/s00_axi_aresetn] [get_bd_pins stream_0/s00_axi_aresetn] [get_bd_pins stream_2/s00_axi_aresetn] \
  [get_bd_pins stream_1/s00_axi_aresetn]
connect_bd_net [get_bd_pins PD_FLAG_block/Res1] \
  [get_bd_pins Res1] [get_bd_pins stream_0/ic_BD_flag] [get_bd_pins stream_1/ic_BD_flag] [get_bd_pins stream_2/ic_BD_flag] \
  [get_bd_pins stream_3/ic_BD_flag] [get_bd_pins ila_0/probe5]
connect_bd_net [get_bd_pins Din] [get_bd_pins soft_reset/Din]
connect_bd_net [get_bd_pins adc_clk_soft_aresetn] [get_bd_pins soft_reset/axi_resetn]
connect_bd_net [get_bd_pins s00_axi_aclk] \
  [get_bd_pins stream_0/s00_axi_aclk] [get_bd_pins stream_1/s00_axi_aclk] [get_bd_pins stream_2/s00_axi_aclk] \
  [get_bd_pins stream_3/s00_axi_aclk]
connect_bd_net [get_bd_pins aclk] \
  [get_bd_pins stream_0/aclk] [get_bd_pins stream_1/aclk] [get_bd_pins stream_2/aclk] [get_bd_pins stream_3/aclk] \
  [get_bd_pins soft_reset/adc_aclk] [get_bd_pins ila_0/clk]
connect_bd_net [get_bd_pins s00_axis_tvalid] \
  [get_bd_pins stream_0/s00_axis_tvalid] [get_bd_pins stream_1/s00_axis_tvalid] [get_bd_pins stream_3/s00_axis_tvalid] \
  [get_bd_pins stream_2/s00_axis_tvalid] [get_bd_pins ila_0/probe4]

current_bd_instance /SPB_blocks/PD_FLAG_block
connect_bd_net [get_bd_pins util_vector_logic_0/Res] [get_bd_pins util_vector_logic_2/Op1]
connect_bd_net [get_bd_pins util_vector_logic_1/Res] [get_bd_pins util_vector_logic_2/Op2]
connect_bd_net [get_bd_pins util_vector_logic_2/Res] [get_bd_pins Res]
connect_bd_net [get_bd_pins util_vector_logic_4/Res] [get_bd_pins util_vector_logic_5/Op1]
connect_bd_net [get_bd_pins util_vector_logic_3/Res] [get_bd_pins util_vector_logic_5/Op2]
connect_bd_net [get_bd_pins util_vector_logic_5/Res] [get_bd_pins Res1]
connect_bd_net -net Op1_1 [get_bd_pins Op1] [get_bd_pins util_vector_logic_6/Op1]
connect_bd_net [get_bd_pins util_vector_logic_6/Res] [get_bd_pins util_vector_logic_0/Op1]
connect_bd_net -net Op2_1 [get_bd_pins Op2] [get_bd_pins util_vector_logic_7/Op1]
connect_bd_net [get_bd_pins util_vector_logic_7/Res] [get_bd_pins util_vector_logic_0/Op2]
connect_bd_net -net Op3_1 [get_bd_pins Op3] [get_bd_pins util_vector_logic_8/Op1]
connect_bd_net [get_bd_pins util_vector_logic_8/Res] [get_bd_pins util_vector_logic_1/Op1]
connect_bd_net -net Op4_1 [get_bd_pins Op4] [get_bd_pins util_vector_logic_9/Op1]
connect_bd_net [get_bd_pins util_vector_logic_9/Res] [get_bd_pins util_vector_logic_1/Op2]
connect_bd_net -net Op7_1 [get_bd_pins Op7] [get_bd_pins util_vector_logic_11/Op1]
connect_bd_net [get_bd_pins util_vector_logic_11/Res] [get_bd_pins util_vector_logic_3/Op1]
connect_bd_net -net Op8_1 [get_bd_pins Op8] [get_bd_pins util_vector_logic_10/Op1]
connect_bd_net [get_bd_pins util_vector_logic_10/Res] [get_bd_pins util_vector_logic_3/Op2]
connect_bd_net -net Op5_1 [get_bd_pins Op5] [get_bd_pins util_vector_logic_13/Op1]
connect_bd_net [get_bd_pins util_vector_logic_13/Res] [get_bd_pins util_vector_logic_4/Op1]
connect_bd_net -net Op6_1 [get_bd_pins Op6] [get_bd_pins util_vector_logic_12/Op1]
connect_bd_net [get_bd_pins util_vector_logic_12/Res] [get_bd_pins util_vector_logic_4/Op2]
connect_bd_net -net Op9_1 [get_bd_pins Op9] [get_bd_pins util_vector_logic_13/Op2] [get_bd_pins util_vector_logic_9/Op2]
connect_bd_net -net Op10_1 [get_bd_pins Op10] [get_bd_pins util_vector_logic_7/Op2] [get_bd_pins util_vector_logic_12/Op2]
connect_bd_net -net Op11_1 [get_bd_pins Op11] [get_bd_pins util_vector_logic_11/Op2] [get_bd_pins util_vector_logic_6/Op2]
connect_bd_net -net Op12_1 [get_bd_pins Op12] [get_bd_pins util_vector_logic_10/Op2] [get_bd_pins util_vector_logic_8/Op2]

current_bd_instance /SPB_blocks/stream_0
connect_bd_intf_net [get_bd_intf_pins S01_AXIS1] [get_bd_intf_pins packet_detector_11AD_0/S01_AXIS]
connect_bd_intf_net [get_bd_intf_pins packet_detector_11AD_0/M00_AXIS] [get_bd_intf_pins RX_Block_AP_0/S00_AXIS]
connect_bd_intf_net [get_bd_intf_pins packet_detector_11AD_0/M01_AXIS] [get_bd_intf_pins RX_Block_AP_0/S01_AXIS]
connect_bd_intf_net [get_bd_intf_pins S00_AXIS1] [get_bd_intf_pins packet_detector_11AD_0/S00_AXIS]
connect_bd_intf_net [get_bd_intf_pins S00_AXI] [get_bd_intf_pins RX_Block_AP_0/S00_AXI]
connect_bd_intf_net [get_bd_intf_pins S00_AXI2] [get_bd_intf_pins packet_detector_11AD_0/S00_AXI]
connect_bd_net [get_bd_pins adc_clk_soft_aresetn] [get_bd_pins RX_Block_AP_0/adc_440_aresetn] [get_bd_pins packet_detector_11AD_0/aresetn]
connect_bd_net [get_bd_pins s00_axi_aresetn] [get_bd_pins RX_Block_AP_0/s00_axi_aresetn] [get_bd_pins packet_detector_11AD_0/s00_axi_aresetn]
connect_bd_net [get_bd_pins s00_axi_aclk] [get_bd_pins RX_Block_AP_0/s00_axi_aclk] [get_bd_pins packet_detector_11AD_0/s00_axi_aclk]
connect_bd_net [get_bd_pins aclk] [get_bd_pins RX_Block_AP_0/adc_440_aclk] [get_bd_pins packet_detector_11AD_0/aclk]
connect_bd_net [get_bd_pins packet_detector_11AD_0/PD_FLAG] [get_bd_pins PD_FLAG]
connect_bd_net [get_bd_pins ic_BD_flag] [get_bd_pins RX_Block_AP_0/ic_BD_flag]
connect_bd_net [get_bd_pins RX_Block_AP_0/oc_BD_flag] [get_bd_pins o_BD_FLAG]
connect_bd_net [get_bd_pins i_PD_FLAG] [get_bd_pins RX_Block_AP_0/ic_PD_flag]
connect_bd_net [get_bd_pins adc_220_aclk] [get_bd_pins RX_Block_AP_0/adc_220_aclk]
connect_bd_net [get_bd_pins adc_220_aresetn] [get_bd_pins RX_Block_AP_0/adc_220_aresetn]
connect_bd_net [get_bd_pins RX_Block_AP_0/ch_en] [get_bd_pins ch_en]
connect_bd_net [get_bd_pins s00_axis_tvalid] [get_bd_pins packet_detector_11AD_0/s01_axis_tvalid] [get_bd_pins packet_detector_11AD_0/s00_axis_tvalid]

current_bd_instance /SPB_blocks/stream_1
connect_bd_intf_net [get_bd_intf_pins RX_Block_AP_0/S00_AXIS] [get_bd_intf_pins packet_detector_11AD_1/M00_AXIS]
connect_bd_intf_net [get_bd_intf_pins S00_AXI] [get_bd_intf_pins RX_Block_AP_0/S00_AXI]
connect_bd_intf_net [get_bd_intf_pins S03_AXIS] [get_bd_intf_pins packet_detector_11AD_1/S01_AXIS]
connect_bd_intf_net [get_bd_intf_pins RX_Block_AP_0/S01_AXIS] [get_bd_intf_pins packet_detector_11AD_1/M01_AXIS]
connect_bd_intf_net [get_bd_intf_pins S00_AXI8] [get_bd_intf_pins packet_detector_11AD_1/S00_AXI]
connect_bd_intf_net [get_bd_intf_pins S02_AXIS] [get_bd_intf_pins packet_detector_11AD_1/S00_AXIS]
connect_bd_net [get_bd_pins adc_clk_soft_aresetn] [get_bd_pins RX_Block_AP_0/adc_440_aresetn] [get_bd_pins packet_detector_11AD_1/aresetn]
connect_bd_net [get_bd_pins s00_axi_aresetn] [get_bd_pins RX_Block_AP_0/s00_axi_aresetn] [get_bd_pins packet_detector_11AD_1/s00_axi_aresetn]
connect_bd_net [get_bd_pins s00_axi_aclk] [get_bd_pins RX_Block_AP_0/s00_axi_aclk] [get_bd_pins packet_detector_11AD_1/s00_axi_aclk]
connect_bd_net [get_bd_pins aclk] [get_bd_pins RX_Block_AP_0/adc_440_aclk] [get_bd_pins packet_detector_11AD_1/aclk]
connect_bd_net [get_bd_pins packet_detector_11AD_1/PD_FLAG] [get_bd_pins PD_FLAG]
connect_bd_net [get_bd_pins ic_BD_flag] [get_bd_pins RX_Block_AP_0/ic_BD_flag]
connect_bd_net [get_bd_pins i_PD_FLAG] [get_bd_pins RX_Block_AP_0/ic_PD_flag]
connect_bd_net [get_bd_pins RX_Block_AP_0/oc_BD_flag] [get_bd_pins o_BD_FLAG]
connect_bd_net [get_bd_pins adc_220_aclk] [get_bd_pins RX_Block_AP_0/adc_220_aclk]
connect_bd_net [get_bd_pins adc_220_aresetn] [get_bd_pins RX_Block_AP_0/adc_220_aresetn]
connect_bd_net [get_bd_pins RX_Block_AP_0/ch_en] [get_bd_pins ch_en]
connect_bd_net [get_bd_pins s00_axis_tvalid] [get_bd_pins packet_detector_11AD_1/s01_axis_tvalid] [get_bd_pins packet_detector_11AD_1/s00_axis_tvalid]
